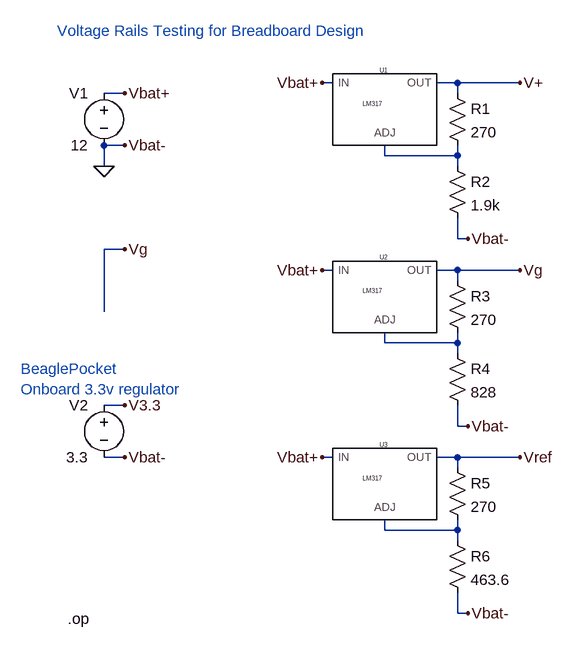
[diagram p0: schematic capstone_rails_bb.asc]
capstone_rails_bb.asc, the LTspice schematic file:
Version 4
SHEET 1 880 908
WIRE -416 -16 -432 -16
WIRE -224 -16 -256 -16
WIRE -128 -16 -224 -16
WIRE -736 0 -768 0
WIRE -224 0 -224 -16
WIRE -736 80 -768 80
WIRE -336 96 -336 80
WIRE -224 96 -224 80
WIRE -224 96 -336 96
WIRE -768 112 -768 80
WIRE -224 112 -224 96
WIRE -224 224 -224 192
WIRE -208 224 -224 224
WIRE -736 240 -768 240
WIRE -416 272 -432 272
WIRE -224 272 -256 272
WIRE -128 272 -224 272
WIRE -224 288 -224 272
WIRE -768 336 -768 240
WIRE -336 384 -336 368
WIRE -224 384 -224 368
WIRE -224 384 -336 384
WIRE -224 400 -224 384
WIRE -736 480 -768 480
WIRE -224 512 -224 480
WIRE -208 512 -224 512
WIRE -736 560 -768 560
WIRE -416 560 -432 560
WIRE -224 560 -256 560
WIRE -128 560 -224 560
WIRE -224 576 -224 560
WIRE -336 672 -336 656
WIRE -224 672 -224 656
WIRE -224 672 -336 672
WIRE -224 688 -224 672
WIRE -224 800 -224 768
WIRE -208 800 -224 800
FLAG -736 0 Vbat+
FLAG -128 -16 V+
FLAG -128 272 Vg
FLAG -128 560 Vref
FLAG -736 80 Vbat-
FLAG -432 -16 Vbat+
FLAG -432 272 Vbat+
FLAG -432 560 Vbat+
FLAG -208 800 Vbat-
FLAG -208 512 Vbat-
FLAG -208 224 Vbat-
FLAG -736 240 Vg
FLAG -736 480 V3.3
FLAG -736 560 Vbat-
FLAG -768 112 0
SYMBOL LM317 -336 16 R0
SYMATTR InstName U1
SYMBOL voltage -768 -16 M0
SYMATTR InstName V1
SYMATTR Value 12
SYMBOL res -240 -16 R0
SYMATTR InstName R1
SYMATTR Value 270
SYMBOL res -240 96 R0
SYMATTR InstName R2
SYMATTR Value 1.9k
SYMBOL LM317 -336 304 R0
SYMATTR InstName U2
SYMBOL res -240 272 R0
SYMATTR InstName R3
SYMATTR Value 270
SYMBOL res -240 384 R0
SYMATTR InstName R4
SYMATTR Value 828
SYMBOL LM317 -336 592 R0
SYMATTR InstName U3
SYMBOL res -240 560 R0
SYMATTR InstName R5
SYMATTR Value 270
SYMBOL res -240 672 R0
SYMATTR InstName R6
SYMATTR Value 463.6
SYMBOL voltage -768 464 M0
SYMATTR InstName V2
SYMATTR Value 3.3
TEXT -824 808 Left 2 !.op
TEXT -896 424 Left 2 ;BeaglePocket\nOnboard 3.3v regulator
TEXT -840 -96 Left 2 ;Voltage Rails Testing for Breadboard Design

The netlist it stands for:
* capstone_rails_bb.asc
XU1 Vbat+ N001 V+ LM317  ; pins IN ADJ OUT
V1 Vbat+ 0 12
R1 V+ N001 270
R2 N001 0 1.9k
XU2 Vbat+ N002 Vg LM317  ; pins IN ADJ OUT
R3 Vg N002 270
R4 N002 0 828
XU3 Vbat+ N003 Vref LM317  ; pins IN ADJ OUT
R5 Vref N003 270
R6 N003 0 463.6
V2 V3.3 0 3.3
.op
* BeaglePocket
* Onboard 3.3v regulator
* Voltage Rails Testing for Breadboard Design
.lib LM317.sub
.backanno
.end